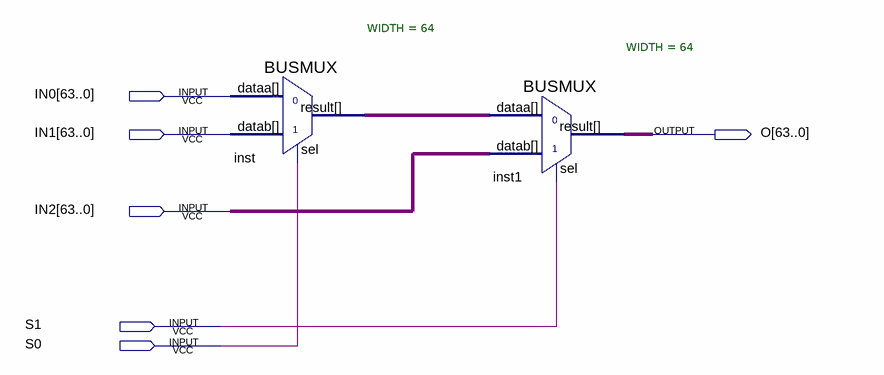
[diagram p0: schematic sheet]
// Quartus schematic 3to1_Mux.bdf as structural Verilog: 2 symbols, 6 pins
module \3to1_Mux  (
  input  [63:0] IN0,
  input  [63:0] IN1,
  input  [63:0] IN2,
  input  S1,
  input  S0,
  output [63:0] O
);

  wire [63:0] inst_result;

  BUSMUX #(.WIDTH(64)) inst (.datab(IN1), .sel(S0), .dataa(IN0), .result(inst_result));
  BUSMUX #(.WIDTH(64)) inst1 (.datab(IN2), .sel(S1), .dataa(inst_result), .result(O));
endmodule
